# EAGLE design v0.9.0 (EAGLE 9.3.0)
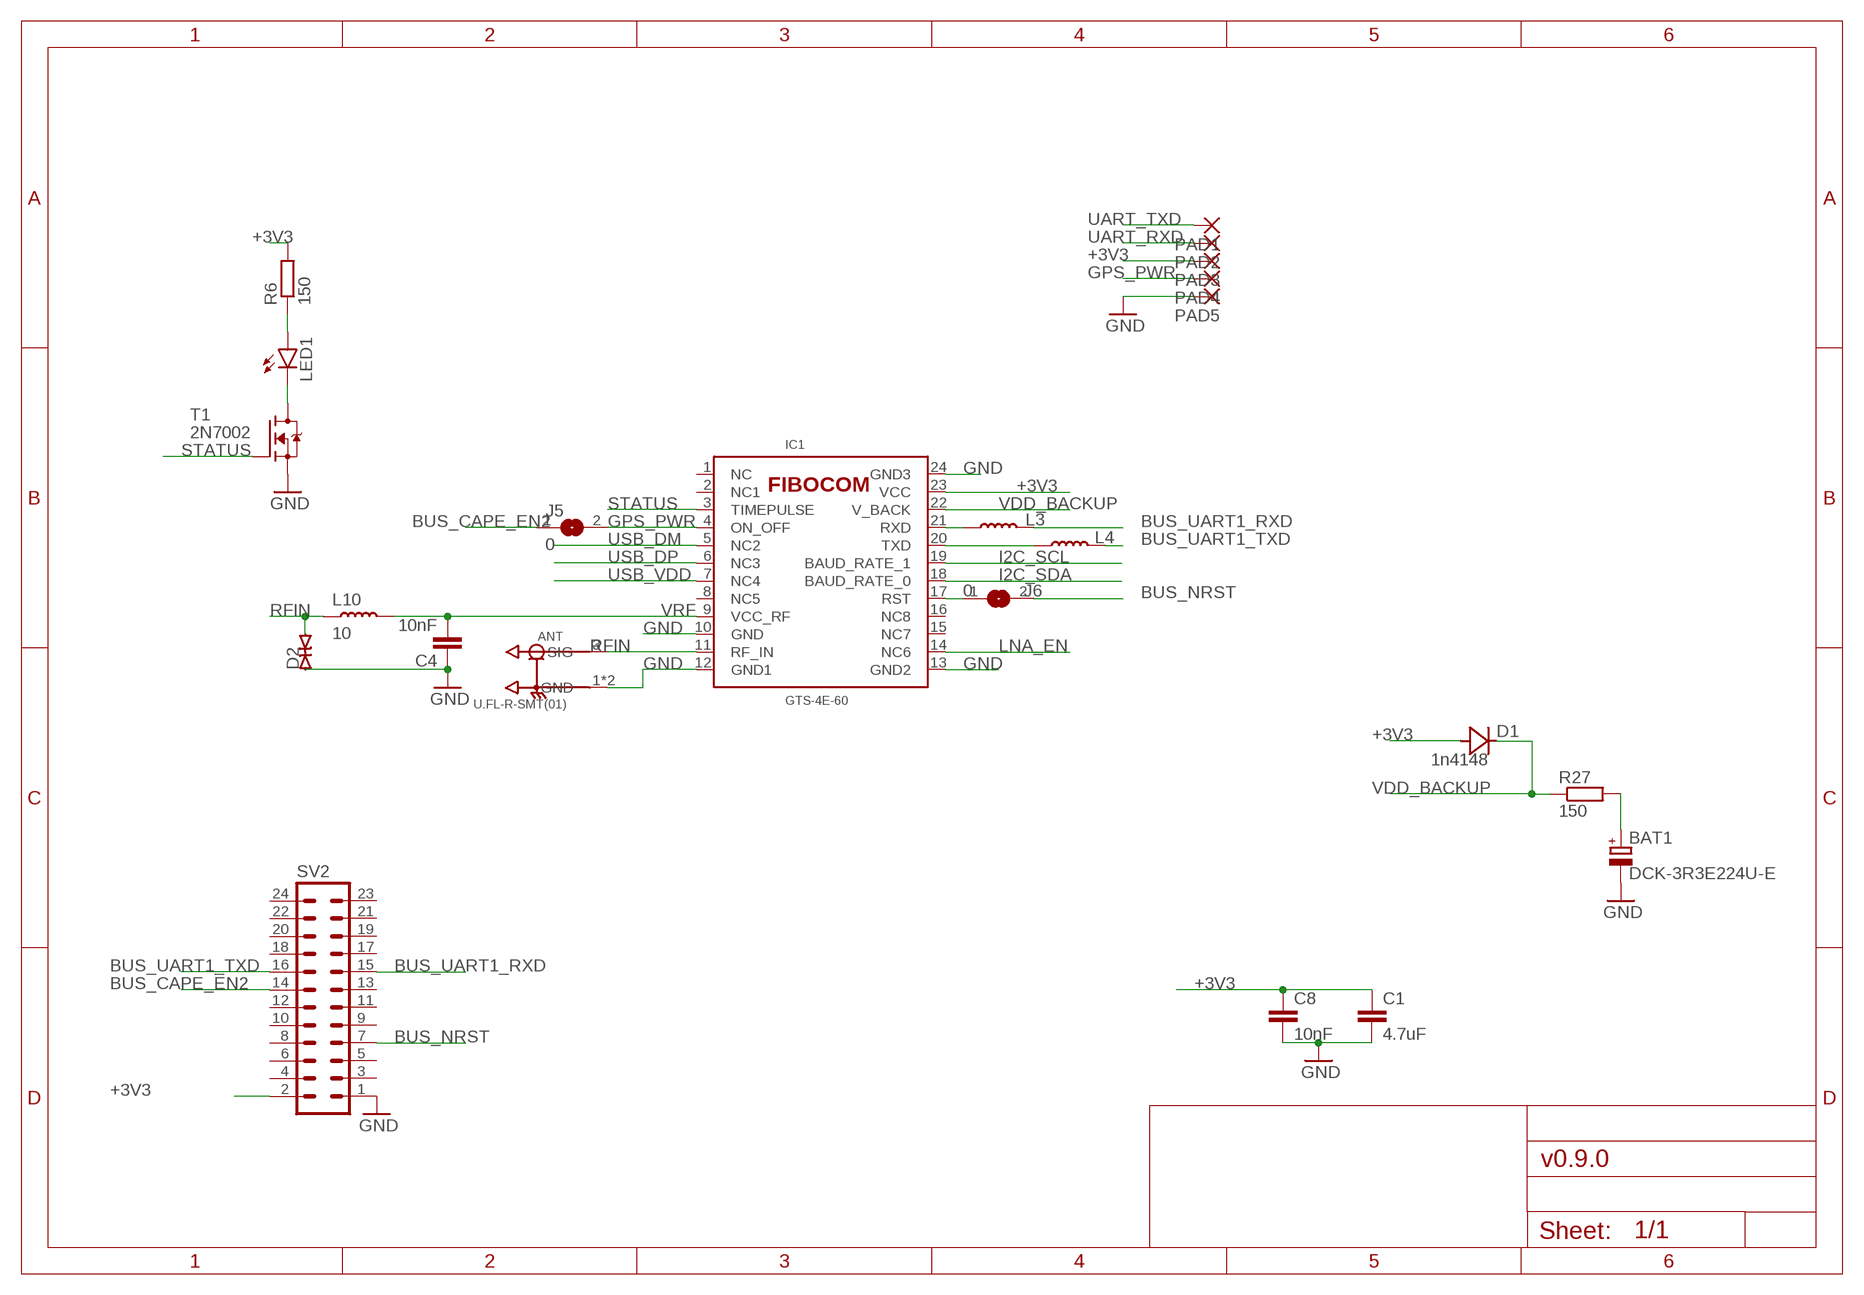
[diagram p0: schematic, sheet 1]

## Parts
ANT  U.FL-R-SMT(01)  [HRS_U.FL-R-SMT(01)]
BAT1  DCK-3R3E224U-E  [621]
C1  4.7uF  CAP-0603  [C0603]
C4  10nF  CAP-0402  [C0402K]
C8  10nF  CAP-0603  [C0603]
D1  1n4148  1N4148WS  [SOD323]
D2  ESD9B5.0ST5G  [SOD1006X40]
IC1  GTS-4E-60  [_GTS_4E_60]
J5  0  JUMP-0603  [C0603]
J6  0  JUMP-0603  [C0603]
L3  blm15  IND-0402  [L0402]
L4  blm15  IND-0402  [L0402]
L10  10  IND-0402  [L0402]
LED1  LEDCHIP-LED0603  [CHIP-LED0603]
PAD1  1,6/0,9  [1,6/0,9]
PAD2  1,6/0,9  [1,6/0,9]
PAD3  1,6/0,9  [1,6/0,9]
PAD4  1,6/0,9  [1,6/0,9]
PAD5  1,6/0,9  [1,6/0,9]
R6  150  RES-0603  [R0603]
R27  150  RES-0603  [R0603]
SV2  MA12-2  [MA12-2]
T1  2N7002  [SOT95P240X110-3]

## Nets
+3V3: C1.1 C8.1 D1.A IC1.23(VCC) PAD3.1(P) R6.2 SV2.2
BUS_CAPE_EN2: J5.1 SV2.14
BUS_NRST: J6.2 SV2.7
BUS_UART1_RXD: L3.2 SV2.15
BUS_UART1_TXD: L4.2 SV2.16
GND: ANT.1(GND) ANT.2(GND) BAT1.- C1.2 C4.1 C8.2 D2.1(A) IC1.10(GND) IC1.12(GND1) IC1.13(GND2) IC1.24(GND3) PAD5.1(P) SV2.1 T1.2(S)
GPS_PWR: IC1.4(ON_OFF) J5.2 PAD4.1(P)
I2C_SCL: IC1.19(BAUD_RATE_1)
I2C_SDA: IC1.18(BAUD_RATE_0)
LNA_EN: IC1.14(NC6)
N$6: LED1.C T1.3(D)
N$8: IC1.17(RST) J6.1
N$12: LED1.A R6.1
N$20: BAT1.+ R27.2
RFIN: ANT.3(SIG) D2.2(C) IC1.11(RF_IN) L10.1
STATUS: IC1.3(TIMEPULSE) T1.1(G)
UART_RXD: IC1.20(TXD) L4.1 PAD2.1(P)
UART_TXD: IC1.21(RXD) L3.1 PAD1.1(P)
USB_DM: IC1.5(NC2)
USB_DP: IC1.6(NC3)
USB_VDD: IC1.7(NC4)
VDD_BACKUP: D1.K(C) IC1.22(V_BACK) R27.1
VRF: C4.2 IC1.9(VCC_RF) L10.2
Unconnected: IC1.1(NC) IC1.2(NC1) IC1.8(NC5) IC1.15(NC7) IC1.16(NC8) SV2.3 SV2.4 SV2.5 SV2.6 SV2.8 SV2.9 SV2.10 SV2.11 SV2.12 SV2.13 SV2.17 SV2.18 SV2.19 SV2.20 SV2.21 SV2.22 SV2.23 SV2.24

## Library data of the parts
ANT = parts-molex:U.FL-R-SMT(01): U.FL Series 6 Ghz 50 Ohm Ultra-small SMT Coaxial Cable Receptacle; AVAILABILITY: Unavailable; DESCRIPTION: U.FL Series 6 Ghz 50 Ohm Ultra-small SMT Coaxial Cable Receptacle; MF: Hirose; MP: U.FL-R-SMT_01_; PACKAGE: None; PRICE: None
BAT1 = parts-elna:DCK-3R3E224U-E
C1 C8 = parts-passives:CAP-; PACKAGE: 0603; RATING: 10V
C4 = parts-passives:CAP-; PACKAGE: 0402; RATING: 6V
D1 = parts-diotec:1N4148WS
D2 = parts-onsemi:ESD9B
IC1 = parts-fibocom:GTS-4E-60: The GTS-4E is a new generation of GPS receiving module. FIBOCOM GTS 4E 60
J5 J6 = parts-helpers:JUMP-
L3 L4 L10 = parts-passives:IND-; CURRENT: 10mA; PACKAGE: 0402
LED1 = led:LED: LED OSRAM: - CHIPLED LG R971, LG N971, LY N971, LG Q971, LY Q971, LO R971, LY R971 LH N974, LH R974 LS Q976, LO Q976, LY Q976 LO Q996 - Hyper CHIPLED LW Q18S LB Q993, LB Q99A, LB R99A - SideLED LS A670, LO A670, LY A670, LG A670, LP A670 LB A673, LV A673, LT A673, LW A673 LH A674 LY A675 LS A676, LA A676, LO A676, LY A676, LW A676 LS A679, LY A679, LG A679 - Hyper Micro SIDELED® LS Y876, LA Y876, LO Y876, LY Y876 LT Y87S - SmartLED LW L88C, LW L88S LB L89C, LB L89S, LG L890 LS L89K, LO L89K, LY L89K LS L896, LA L896, LO L896, LY L896 - TOPLED LS T670, LO T670, LY T670, LG T670, LP T670 LSG T670, LSP T670, LSY T670, LOP T670, LYG T670 LG T671, LOG T671, LSG T671 LB T673, LV T673, LT T673, LW T673 LH T674 LS T676, LA T676, LO T676, LY T676, LB T676, LH T676, LSB T676, LW T676 LB T67C, LV T67C, LT T67C, LS T67K, LO T67K, LY T67K, LW E67C LS E67B, LA E67B, LO E67B, LY E67B, LB E67C, LV E67C, LT E67C LW T67C LS T679, LY T679, LG T679 LS T770, LO T770, LY T770, LG T770, LP T770 LB T773, LV T773, LT T773, LW T773 LH T774 LS E675, LA E675, LY E675, LS T675 LS T776, LA T776, LO T776, LY T776, LB T776 LHGB T686 LT T68C, LB T68C - Hyper Mini TOPLED® LB M676 - Mini TOPLED Santana® LG M470 LS M47K, LO M47K, LY M47K Source: http://www.osram.convergy.de LUXEON: - LUMILED® LXK2-PW12-R00, LXK2-PW12-S00, LXK2-PW14-U00, LXK2-PW14-V00 LXK2-PM12-R00, LXK2-PM12-S00, LXK2-PM14-U00 LXK2-PE12-Q00, LXK2-PE12-R00, LXK2-PE12-S00, LXK2-PE14-T00, LXK2-PE14-U00 LXK2-PB12-K00, LXK2-PB12-L00, LXK2-PB12-M00, LXK2-PB14-N00, LXK2-PB14-P00, LXK2-PB14-Q00 LXK2-PR12-L00, LXK2-PR12-M00, LXK2-PR14-Q00, LXK2-PR14-R00 LXK2-PD12-Q00, LXK2-PD12-R00, LXK2-PD12-S00 LXK2-PH12-R00, LXK2-PH12-S00 LXK2-PL12-P00, LXK2-PL12-Q00, LXK2-PL12-R00 Source: www.luxeon.com KINGBRIGHT: KA-3528ASYC Source: www.kingbright.com
PAD1-PAD5 = wirepad:1,6/0,9: THROUGH-HOLE PAD
R6 R27 = parts-passives:RES-; PACKAGE: 0603
SV2 = con-lstb:MA12-2: PIN HEADER; OC_FARNELL: unknown; OC_NEWARK: unknown
T1 = parts-onsemi:2N7002

## Net classes
1 50_feed: width 1 mm, clearance 0.4 mm
2 usb_dif: width 0.4 mm, clearance 0.8 mm

## Board
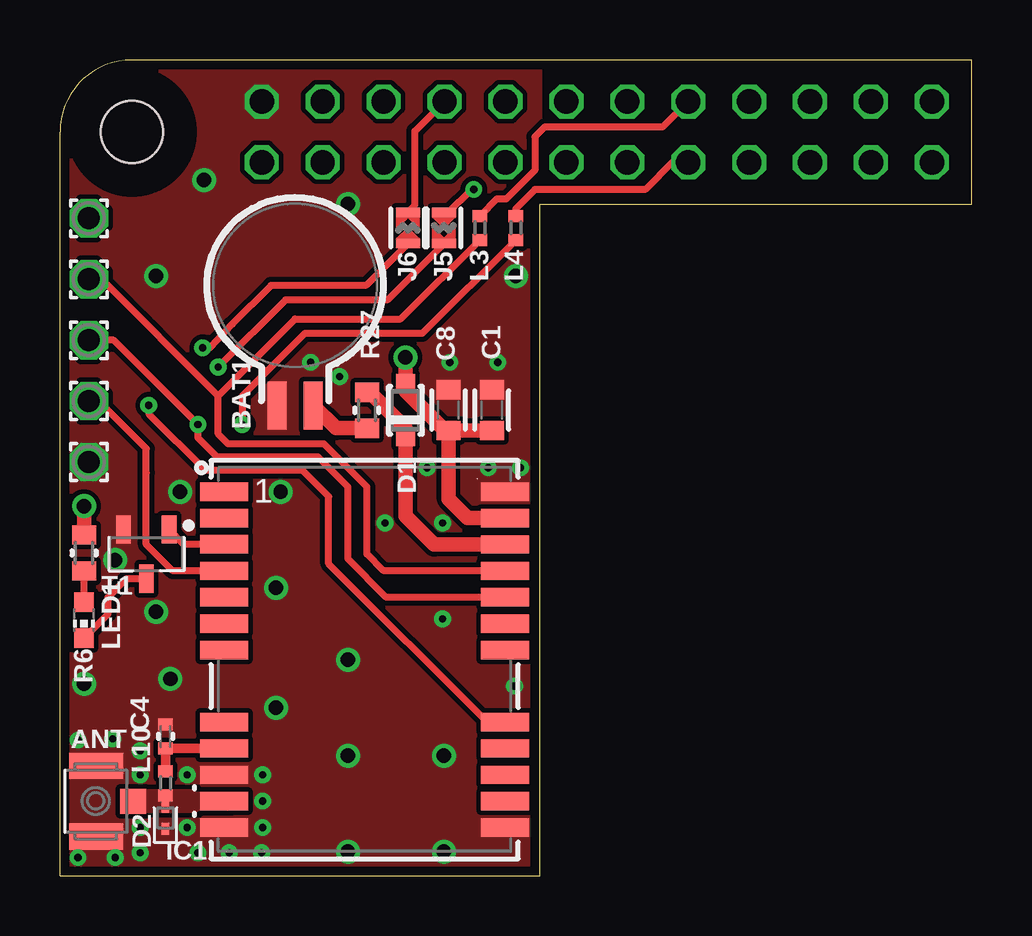
[diagram p1: board, top side]
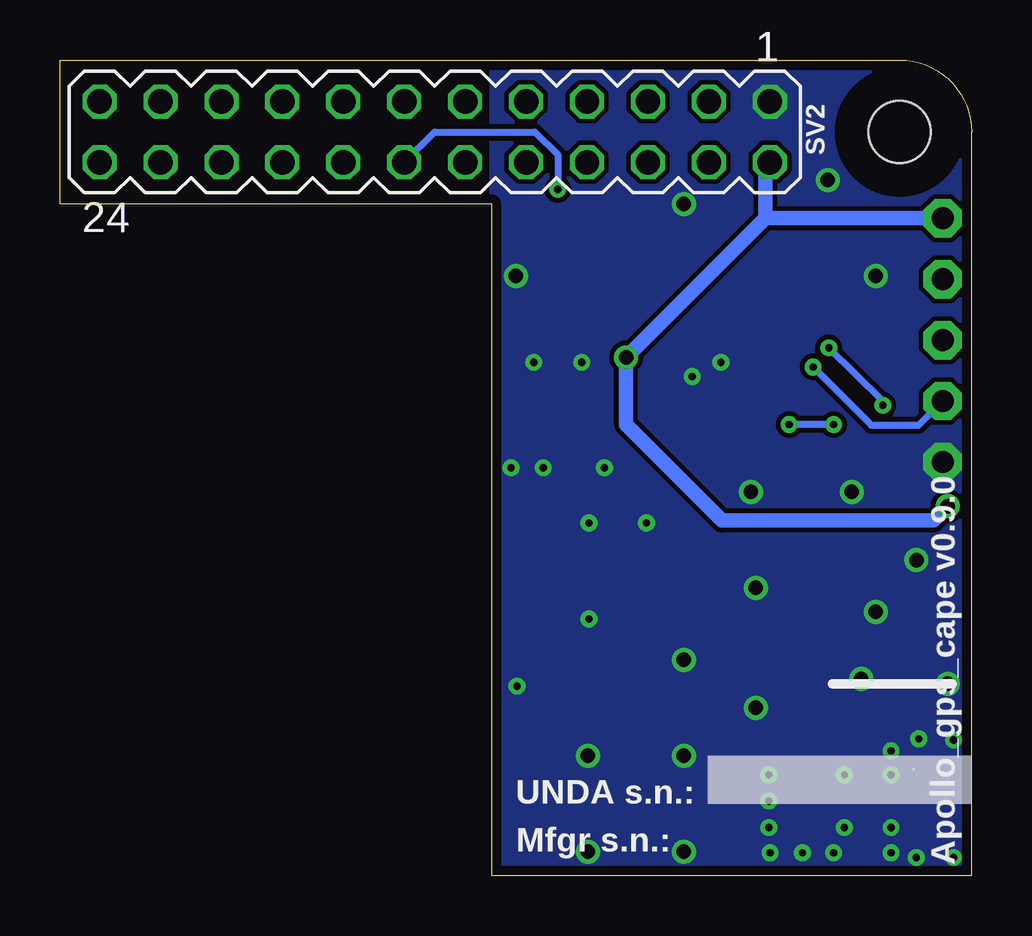
[diagram p2: board, bottom side, seen from below]

Size 38 x 34 mm. Coordinates in mm from the lower left corner, seen from the top.
Outline: 0,0 0,31 arc-90 3,34 38,34 38,28 20,28 20,0 0,0
Copper layers (1*16): Top 0.035mm / dielectric 0.53mm / Bottom 0.035mm
Design rules "default *": minimum track width 0.2mm, minimum drill 0.3mm, track to track 0.2mm, track to pad 0.2mm, pad to pad 0.2mm, via to via 0.2mm, smd to smd 6mil, copper to edge 0.4mm, drill to drill 0.2mm, minimum pad ring 0.2mm, minimum via ring 0.2mm, stop-mask expansion 0.1mm, vias tented up to drill 0.6mm, thermal gap 10mil
Holes 2.6 mm at 3,31
tRestrict: area 0.5,28.5 to 5.5,33.5
bRestrict: area 0.5,28.5 to 5.5,33.5

### Footprints (pad centres in the part's own frame; a part is rotated, then mirrored left to right if it is on the bottom)
HRS_U.FL-R-SMT(01) = smd 1.1 x 2.25: 1 -1.475,0; 2 1.475,0 | smd 1.05 x 1.1: 3 0,-1.55
621 = smd 0.8 x 2: + 0.75,-1.6; - -0.75,-1.6
C0603 = smd 0.8 x 1: 1 -0.85,0; 2 0.85,0
C0402K = smd 0.5 x 0.6: 1 -0.5,0; 2 0.5,0
SOD323 = smd 0.8 x 0.8: A 1.1,0; K -1.1,0
SOD1006X40 = smd 0.495 x 0.32: 1 -0.453,0; 2 0.453,0
_GTS_4E_60 = smd 0.76 x 2: 1 -7,-5.85; 2 -5.9,-5.85; 3 -4.81,-5.85; 4 -3.7,-5.85; 5 -2.6,-5.85; 6 -1.5,-5.85; 7 -0.4,-5.85; 8 2.6,-5.85; 9 3.7,-5.85; 10 4.8,-5.85; 11 5.9,-5.85; 12 7,-5.85; 13 7,5.85; 14 5.9,5.85; 15 4.8,5.85; 16 3.7,5.85; 17 2.6,5.85; 18 -0.4,5.85; 19 -1.5,5.85; 20 -2.6,5.85; 21 -3.7,5.85; 22 -4.8,5.85; 23 -5.9,5.85; 24 -7,5.85
C0603' = smd 0.4 x 1: 1 -0.65,0; 2 0.65,0
L0402 = smd 0.5 x 0.6: 1 -0.5,0; 2 0.5,0
CHIP-LED0603 = smd 0.8 x 0.8: A 0,-0.75; C 0,0.75
1,6/0,9 = drill 0.914 pad 1.6 octagon: 1 0,0
R0603 = smd 0.8 x 1: 1 -0.75,0; 2 0.75,0
MA12-2 = drill 1.016 octagon: 1 -13.97,-1.27; 2 -13.97,1.27; 3 -11.43,-1.27; 4 -11.43,1.27; 5 -8.89,-1.27; 6 -8.89,1.27; 7 -6.35,-1.27; 8 -6.35,1.27; 9 -3.81,-1.27; 10 -3.81,1.27; 11 -1.27,-1.27; 12 -1.27,1.27; 13 1.27,-1.27; 14 1.27,1.27; 15 3.81,-1.27; 16 3.81,1.27; 17 6.35,-1.27; 18 6.35,1.27; 19 8.89,-1.27; 20 8.89,1.27; 21 11.43,-1.27; 22 11.43,1.27; 23 13.97,-1.27; 24 13.97,1.27
SOT95P240X110-3 = smd 1.18 x 0.609: 1 -1.024,0.95; 2 -1.024,-0.95; 3 1.024,0

### Placement (x,y rotation side)
ANT  1.5,3.1 90 top
BAT1  9.8,21.2 0 top
C1  18,19.4 90 top
C4  4.4,5.8 270 top
C8  16.2,19.4 90 top
D1  14.4,19.4 90 top
D2  4.4,2.4 90 top
IC1  12.7,9 270 top
J5  0  [C0603']  16,27 270 top
J6  0  [C0603']  14.5,27 90 top
L3  17.5,27 90 top
L4  19,27 90 top
L10  4.4,3.85 90 top
LED1  1,10.65 180 top
PAD1  1.2,24.86 0 top
PAD2  1.2,22.32 0 top
PAD3  1.2,27.4 0 top
PAD4  1.2,19.78 0 top
PAD5  1.2,17.24 0 top
R6  1,13.45 90 top
R27  12.8,19.4 270 top
SV2  22.38,31 180 bottom
T1  3.6,13.4 270 top

### Tracks (layer width: path | path; a pad name or v marks a point on that pad's centre or on a via)
+3V3  (via drill 0.6)
  Top 0.6: IC1.23 17,14.9 16.2,15.7 C8.1 | C1.1 C8.1 | C8.1 16.05,18.55 14.4,20.2 D1.A v14.4,21.6 | R6.2 v1,15.4
  Bottom 0.6: v1,15.4 1.6,14.8 10.4,14.8 14.4,18.8 v14.4,21.6 8.6,27.4 | 8.6,27.4 PAD3.1 | 8.6,27.4 8.6,29.54 SV2.2
BUS_CAPE_EN2  (via drill 0.3)
  Top 0.2: J5.1 16.2,27.65
  Top 0.3: v17.25,28.6 17.15,28.6 16.2,27.65
  Bottom 0.3: SV2.14 22.38,31 18.2,31 17.25,30.05 v17.25,28.6
BUS_NRST
  Top 0.3: SV2.7 14.8,31.04 14.8,27.95 J6.2
BUS_UART1_RXD
  Top 0.3: SV2.15 25.12,31.2 20.2,31.2 19.8,30.8 19.8,29.4 18.6,28.2 18.2,28.2 L3.2
BUS_UART1_TXD
  Top 0.3: SV2.16 25.53,29.73 24.4,28.6 19.8,28.6 19,27.8 L4.2
GND  (via drill 0.3, 0.6)
  other vias: 5.3,4.2 5.3,2 3.35,4.2 3.35,2 3.35,0.95 0.75,0.75 2.3,0.75 0.75,5.65 2.2,5.7 3.35,5.2 8.45,4.2 8.45,3.1 8.45,2 8.4,0.95 7.05,0.95 5.75,0.95 19.2,17 17.85,17 15.3,17 15.95,14.7 13.55,14.7 15.95,10.7 18.95,7.9 18.25,21.4 16.25,21.4 11.65,20.8 10.45,21.4 9.2,16 9,7 16,1 12,1 12,5 16,5 12,9 4,11 1,8 9,12 5,16 4,25 12,28 19,25 6,29 4.6,8.2 2.3,13.15
  pour Bottom (isolate 0.2, no thermals): -1,0 20,0 20,35 -1,35
  pour Top (isolate 0.2, rank 6, no thermals): -2,0 20,0 20,36 -2,36
GPS_PWR  (via drill 0.3)
  Top 0.3: IC1.4 4.7,12.7 3.6,13.8 3.6,16.8 3.6,17.8 1.62,19.78 PAD4.1 | J5.2 13.65,24 9.4,24 v6.6,21.2
  Bottom 0.3: v6.6,21.2 4.18,18.78 2.2,18.78 PAD4.1
N$6
  Top 0.3: LED1.C 2,10.9 2,11.6 2.78,12.38 T1.3
N$8  (via drill 0.3)
  Top 0.3: IC1.17 17.8,6.4 11.2,13 11.2,15.8 10.1,16.9 6.05,16.9 3.7,19.25 v3.7,19.6 | J6.1 12.75,24.6 8.8,24.6 7.18,22.98 6.25,22 v5.95,22
  Bottom 0.3: v3.7,19.6 3.72,19.8 v5.95,22
N$12
  Top 0.3: LED1.A R6.1
N$20
  Top 0.6: R27.2 11.5,18.65 BAT1.+
RFIN
  pour Top (no thermals): 2.9,3.55 2.9,2.65 5.65,2.65 5.75,2.75 7,2.75 7,3.45 5.7,3.45 5.6,3.55
STATUS
  Top 0.3: IC1.3 5.16,13.81 T1.1
UART_RXD  (via drill 0.3)
  Top 0.3: IC1.20 13.6,11.6 12,13.2 12,16.2 10.75,17.45 6.55,17.45 5.75,18.25 v5.75,18.8 2.23,22.32 PAD2.1 | L4.1 15.1,22.6 10.2,22.6 7.6,20 v7.6,18.8
  Bottom 0.3: v5.75,18.8 v7.6,18.8
UART_TXD
  Top 0.3: IC1.21 13.5,12.7 12.8,13.4 12.8,16.2 11,18 7,18 6.6,18.4 6.6,20 | L3.1 14.2,23.2 9.8,23.2 6.6,20 | 6.6,20 1.74,24.86 PAD1.1
VDD_BACKUP
  Top 0.6: IC1.22 15.6,13.8 14.4,15 D1.K 14.4,18.66 12.91,20.15 R27.1
VRF
  Top 0.4: IC1.9 C4.2 | C4.2 | C4.2 L10.2

### Text on the board
bNames: UNDA s.n.: | Mfgr s.n.: | Apollo_gps_cape v0.9.0